# Altium schematic sheet GPS.SchDoc: GPS
size A4; SheetNumber: 7; SheetTotal: 13
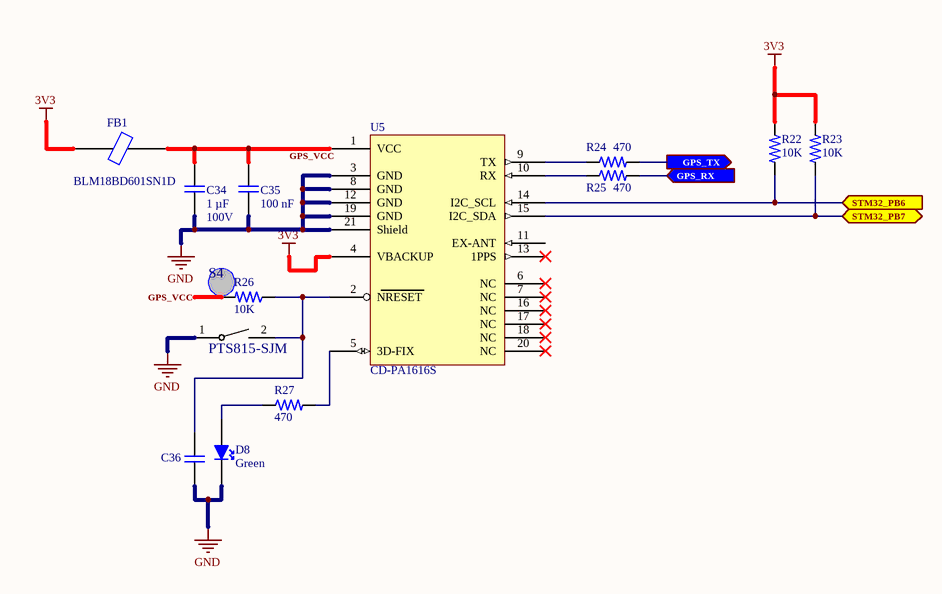
[diagram p0: GPS.SchDoc]

## Parts
C34  1 µF  Voltage Rating: 100V  [MergenElektronik_Capacitors_Ceramics_SMDs_1206_M_NS]
C35  100 nF  [MergenElektronik_Capacitors_Ceramics_SMDs_0603_M_NS]
C36  100 nF  [MergenElektronik_Capacitors_Ceramics_SMDs_0603_M_NS]  (value not drawn)
D8  Green  [MergenElektronik_Leds_SMDs_0603_M_NS]
FB1  BLM18BD601SN1D  [MergenElektronik_Filters_FerriteBeads_0603_M_NS]
R22  10K  [MergenElektronik_Resistors_ChipResistors_0603_M_NS]
R23  10K  [MergenElektronik_Resistors_ChipResistors_0603_M_NS]
R24  470  [MergenElektronik_Resistors_ChipResistors_0603_M_NS]
R25  470  [MergenElektronik_Resistors_ChipResistors_0603_M_NS]
R26  10K  [MergenElektronik_Resistors_ChipResistors_0603_M_NS]
R27  470  [MergenElektronik_Resistors_ChipResistors_0603_M_NS]
S4  PTS815-SJM  [MergenElektronik_Switches_TactileSwitches_PTS815]
U5  CD-PA1616S  [MergenElektronik_Modules_GPS_CD-PA1616S]

## Ports
GPS_RX (in, see Microcontroller[4B]), GPS_TX (out, see Microcontroller[3B]), STM32_PB6 (in, see Altimeter[3B], Gyro[4B], Microcontroller[2C], PressureandTemperature[3B]), STM32_PB7 (bidir, see Altimeter[3B], Gyro[4C], Microcontroller[2C], PressureandTemperature[3B])

## Nets
3V3: FB1.1 R22.1 R23.1 U5.4(VBACKUP)
GND: C34.2 C35.2 C36.2 D8.2(KATOT) S4.1 U5.3(GND) U5.8(GND) U5.12(GND) U5.19(GND) U5.21(Shield)
GPS_RX: R25.2 ; port GPS_RX
GPS_TX: R24.2 ; port GPS_TX
GPS_VCC: C34.1 C35.1 FB1.2 R26.2 U5.1(VCC)
STM32_PB6: R22.2 U5.14(I2C_SCL) ; port STM32_PB6
STM32_PB7: R23.2 U5.15(I2C_SDA) ; port STM32_PB7
NetC36_1: C36.1 R26.1 S4.2 U5.2(NRESET)
NetD8_1: D8.1(ANOT) R27.1
NetR24_1: R24.1 U5.9(TX)
NetR25_1: R25.1 U5.10(RX)
NetR27_2: R27.2 U5.5(3D-FIX)

Not connected (* = marked no-connect by the designer): U5 6(NC)* 7(NC)* 11(EX-ANT) 13(1PPS)* 16(NC)* 17(NC)* 18(NC)* 20(NC)*

## Notes on the sheet
- Title:
- Size:
- Date:
- A4
- Number:
- Time:
- Revision:
- Sheet
- of
- Project
- Drawn By :

## Library data of the parts
C34 = MergenElektronik_Capacitors_Ceramic_SMDs_1µF_100V: Mergen Elektronik - Capacitors - Ceramics - SMDs - 1206 - 1 µF - 100V; Manufacturer: Samsung Electro-Mechanics; Manufacturer Number: CL31B105KCHNNNE; Model: Ceramic Capacitors; Tolerance: ±10%; Value: 1 µF; Temperature: -55°C up to +125°C; Digi-Key Number: 1276-1838-1-ND; Package: 1206(3216 Metric); Mouser Number: 187-CL31B105KCHNNNE; Mounting Type: Surface Mount; Özdisan Number: CL31B105KCHNNNE; Supplier 1: Digikey; Supplier 2: Mouser; Supplier Part Number 1: 1276-1838-1-ND; Supplier Part Number 2: 187-CL31B105KCHNNNE
C35 C36 = MergenElektronik_Capacitors_Ceramic_SMDs_100nF_100V: Mergen Elektronik - Capacitors - Ceramics - SMDs - 0603 - 100 nF - 100V; Manufacturer: Samsung Electro-Mechanics; Manufacturer Number: CL10B104KC8NNNC; Model: Ceramic Capacitors; Tolerance: ±10%; Value: 100 nF; Temperature: -55°C up to +125°C; Digi-Key Number: 1276-6807-1-ND; Package: 0603(1608 Metric); Mouser Number: 187-CL10B104KC8NNNC; Mounting Type: Surface Mount; Farnell Number: 3013412; Özdisan Number: CL10B104KC8NNNC; Supplier 1: Digikey; Supplier 2: Mouser; Supplier Part Number 1: 1276-6807-1-ND; Supplier Part Number 2: 187-CL10B104KC8NNNC; Voltage Rating: 100V
D8 = MergenElektronik_LEDs_SMDs_Green_0603: Mergen Elektronik - Leds - SMDs - Green - 0603; Manufacturer: Würth Elektronik; Manufacturer Number: 150060GS75000; Model: SMD Leds; Voltage Rating: 3.2V; Value: Green; Temperature: -45°C up to +85°C; Digi-Key Number: 732-4971-1-ND; Package: 0603(1608); Farnell Number: 2322070; Mouser Number: 710-150060GS75000; Mounting Type: Surface Mount; Color: Green; Özdisan Number: 150060GS75000; Supplier 1: Digi-Key; Supplier 2: Mouser; Supplier Part Number 1: 732-4971-6-ND; Supplier Part Number 2: 710-150060GS75000
FB1 = MergenElektronik_Filters_FerriteBeads_BLM18BD601SN1D: Mergen Elektronik - Filters - Ferrite Beads - BLM18BD601SN1D; Manufacturer: Murata Electronics; Impedance @ Frequency: 600 Ohms @ 100 MHz; Current Rating: 200mA; DC Resistance: 650mOhm; Manufacturer Number: BLM18BD601SN1D; Mounting Type: Surface Mount; Package: 0603(1608 Metric); Temperature: -55°C up to 125°C; Digi-Key Number: 490-1023-2-ND; Farnell Number: 1515713; Mouser Number: 81-BLM11B601S; Supplier 1: Digi-Key; Supplier 2: Mouser; Supplier Part Number 1: 490-1023-2-ND; Supplier Part Number 2: 81-BLM11B601S
R22 R23 R26 = MergenElektronik_Resistors_ChipResistors_0603_10K: Mergen Elektronik - Resistors - Chip Resistors - 0603 - 10K; Manufacturer: Stackpole Electronics Inc; Manufacturer Number: RMCF0603JT10K0; Value: Chip Resistor - 0603 - 10K; Power: 1/10W; Tolerance: ±5%; Package: 0603(1608); Temperature: -55°C up to +155°C - X8R; Model: Chip Resistor; Digi-Key Number: RMCF0603JT10K0CT-ND; Mounting Type: Surface Mount; Supplier 1: Digi-Key; Supplier Part Number 1: RMCF0603JT10K0-ND
R24 R25 R27 = MergenElektronik_Resistors_ChipResistors_0603_470: Mergen Elektronik - Resistors - Chip Resistors - 0603 - 470; Manufacturer: Stackpole Electronics Inc; Manufacturer Number: RMCF0603JT470R; Value: Chip Resistor - 0603 - 470; Power: 1/10W; Tolerance: ±5%; Package: 0603(1608); Temperature: -55°C up to +155°C - X8R; Model: Chip Resistor; Digi-Key Number: RMCF0603JT470RTR-ND; Mounting Type: Surface Mount; Mouser Number: 708-RMCF0603JT470R; Supplier 1: Digikey; Supplier 2: Mouser; Supplier Part Number 2: 708-RMCF0603JT470R; Supplier Part Number 1: RMCF0603JT470RTR-ND
S4 = MergenElektronik_Switches_TactileSwitches_PTS815-SJM: Mergen Elektronik - Switches - Tactile  Switches; Manufacturer Number: PTS815 SJM 250 SMTR LFS; Manufacturer: C&K; Current Rating: 50mA; Voltage Rating: 12VDC; Digi-Key Number: CKN12215-1-ND; Model: Tactile Switches; Mounting Type: Surface Mount; Package: PTS815; Temperature: -20°C up to +70°C; Value: PTS815-SJM; Mouser Number: 611-PTS815SJM250SMTR; Farnell Number: 3780619; Supplier 1: Mouser; Supplier 2: Digi-Key; Supplier Part Number 1: 611-PTS815SJM250SMTR; Supplier Part Number 2: CKN12215-6-ND
U5 = MergenElektronik_Modules_GPS: Mergen Elektronik -  Modules - GPS - CD-PA1616S; Manufacturer: Adafruit; Manufacturer Number: 790; Model: GPS Module; Update Rate: 1Hz up to 10 Hz; Tolerance: < 3 meters; Operating Supply Voltage: 3.0 up to 5.5VDC; Package: CD-PA1616S; Temperature: -40 °C  up to +85 °C; Mounting Type: Surface Mount; Value: CD-PA1616S